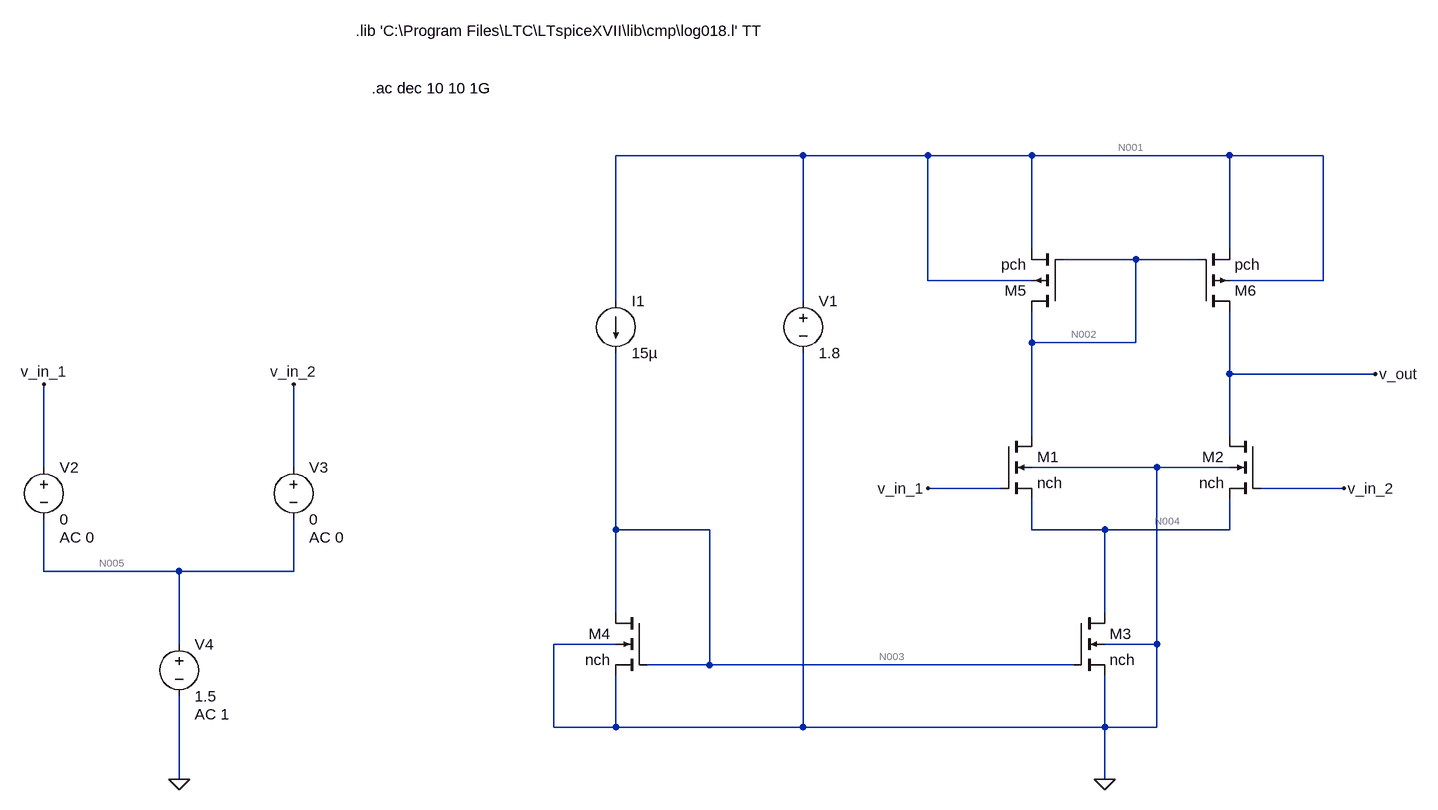
[diagram p0: schematic differential-pair-current-mirror.asc]
differential-pair-current-mirror.asc, the LTspice schematic file:
Version 4
SHEET 1 1352 1076
WIRE 352 96 64 96
WIRE 544 96 352 96
WIRE 704 96 544 96
WIRE 1008 96 704 96
WIRE 1152 96 1008 96
WIRE 704 240 704 96
WIRE 1008 240 1008 96
WIRE 864 256 752 256
WIRE 960 256 864 256
WIRE 544 288 544 96
WIRE 704 288 544 288
WIRE 1152 288 1152 96
WIRE 1152 288 1008 288
WIRE 64 320 64 96
WIRE 352 320 352 96
WIRE 704 384 704 336
WIRE 864 384 864 256
WIRE 864 384 704 384
WIRE 1008 432 1008 336
WIRE 1232 432 1008 432
WIRE 704 528 704 384
WIRE 1008 528 1008 432
WIRE -816 576 -816 448
WIRE -432 576 -432 448
WIRE 896 576 704 576
WIRE 1008 576 896 576
WIRE 656 608 544 608
WIRE 1184 608 1056 608
WIRE 64 672 64 400
WIRE 208 672 64 672
WIRE 704 672 704 624
WIRE 816 672 704 672
WIRE 1008 672 1008 624
WIRE 1008 672 816 672
WIRE -816 736 -816 656
WIRE -608 736 -816 736
WIRE -432 736 -432 656
WIRE -432 736 -608 736
WIRE 64 800 64 672
WIRE 816 800 816 672
WIRE -608 848 -608 736
WIRE 64 848 -32 848
WIRE 896 848 896 576
WIRE 896 848 816 848
WIRE 208 880 208 672
WIRE 208 880 112 880
WIRE 768 880 208 880
WIRE -32 976 -32 848
WIRE 64 976 64 896
WIRE 64 976 -32 976
WIRE 352 976 352 400
WIRE 352 976 64 976
WIRE 816 976 816 896
WIRE 816 976 352 976
WIRE 896 976 896 848
WIRE 896 976 816 976
WIRE -608 1056 -608 928
WIRE 816 1056 816 976
FLAG 816 1056 0
FLAG -608 1056 0
FLAG 544 608 v_in_1
FLAG 1184 608 v_in_2
FLAG -816 448 v_in_1
FLAG -432 448 v_in_2
FLAG 1232 432 v_out
SYMBOL nmos4 656 528 R0
SYMATTR InstName M1
SYMATTR Value nch
SYMATTR Value2 l=1u w=15u
SYMBOL nmos4 1056 528 M0
SYMATTR InstName M2
SYMATTR Value nch
SYMATTR Value2 l=1u w=15u
SYMBOL nmos4 768 800 R0
SYMATTR InstName M3
SYMATTR Value nch
SYMATTR Value2 l=1u w=30u
SYMBOL nmos4 112 800 M0
SYMATTR InstName M4
SYMATTR Value nch
SYMATTR Value2 l=1u w=15u
SYMBOL pmos4 752 336 R180
SYMATTR InstName M5
SYMATTR Value pch
SYMATTR Value2 l=1u w=30u
SYMBOL pmos4 960 336 M180
SYMATTR InstName M6
SYMATTR Value pch
SYMATTR Value2 l=1u w=30u
SYMBOL current 64 320 R0
SYMATTR InstName I1
SYMATTR Value 15µ
SYMBOL voltage 352 304 R0
WINDOW 123 0 0 Left 0
WINDOW 39 0 0 Left 0
SYMATTR InstName V1
SYMATTR Value 1.8
SYMBOL voltage -816 560 R0
WINDOW 123 24 124 Left 2
WINDOW 39 0 0 Left 0
SYMATTR Value2 AC 0
SYMATTR InstName V2
SYMATTR Value 0
SYMBOL voltage -608 832 R0
WINDOW 123 24 124 Left 2
WINDOW 39 0 0 Left 0
SYMATTR Value2 AC 1
SYMATTR InstName V4
SYMATTR Value 1.5
SYMBOL voltage -432 560 R0
WINDOW 123 24 124 Left 2
WINDOW 39 0 0 Left 0
SYMATTR Value2 AC 0
SYMATTR InstName V3
SYMATTR Value 0
TEXT -336 -96 Left 2 !.lib 'C:\\Program Files\\LTC\\LTspiceXVII\\lib\\cmp\\log018.l' TT
TEXT -312 -8 Left 2 !.ac dec 10 10 1G

The netlist it stands for:
* differential-pair-current-mirror.asc
M1 N002 v_in_1 N004 0 nch l=1u w=15u
M2 v_out v_in_2 N004 0 nch l=1u w=15u
M3 N004 N003 0 0 nch l=1u w=30u
M4 N003 N003 0 0 nch l=1u w=15u
M5 N002 N002 N001 N001 pch l=1u w=30u
M6 v_out N002 N001 N001 pch l=1u w=30u
I1 N001 N003 15µ
V1 N001 0 1.8
V2 v_in_1 N005 0 AC 0
V4 N005 0 1.5 AC 1
V3 v_in_2 N005 0 AC 0
.model NMOS NMOS
.model PMOS PMOS
.lib standard.mos
.lib 'C:\Program Files\LTC\LTspiceXVII\lib\cmp\log018.l' TT
.ac dec 10 10 1G
.backanno
.end

* Results of the author's LTspice run, read from the files saved beside the schematic
* Operating Point, zero values left out:
*   V(n002) = 1.239 V
*   V(v_in_1) = 1.5 V
*   V(n004) = 802.9 mV
*   V(v_out) = 1.239 V
*   V(v_in_2) = 1.5 V
*   V(n003) = 499.4 mV
*   V(n001) = 1.8 V
*   V(n005) = 1.5 V
*   Id(M6) = -15.36 µA
*   Is(M6) = 15.36 µA
*   Id(M5) = -15.36 µA
*   Is(M5) = 15.36 µA
*   Id(M4) = 15 µA
*   Is(M4) = -15 µA
*   Id(M3) = 30.73 µA
*   Ib(M3) = -1.595 pA
*   Is(M3) = -30.73 µA
*   Id(M2) = 15.36 µA
*   Ib(M2) = -2.062 pA
*   Is(M2) = -15.36 µA
*   Id(M1) = 15.36 µA
*   Ib(M1) = -2.062 pA
*   Is(M1) = -15.36 µA
*   I(I1) = 15 µA
*   I(V1) = -45.73 µA